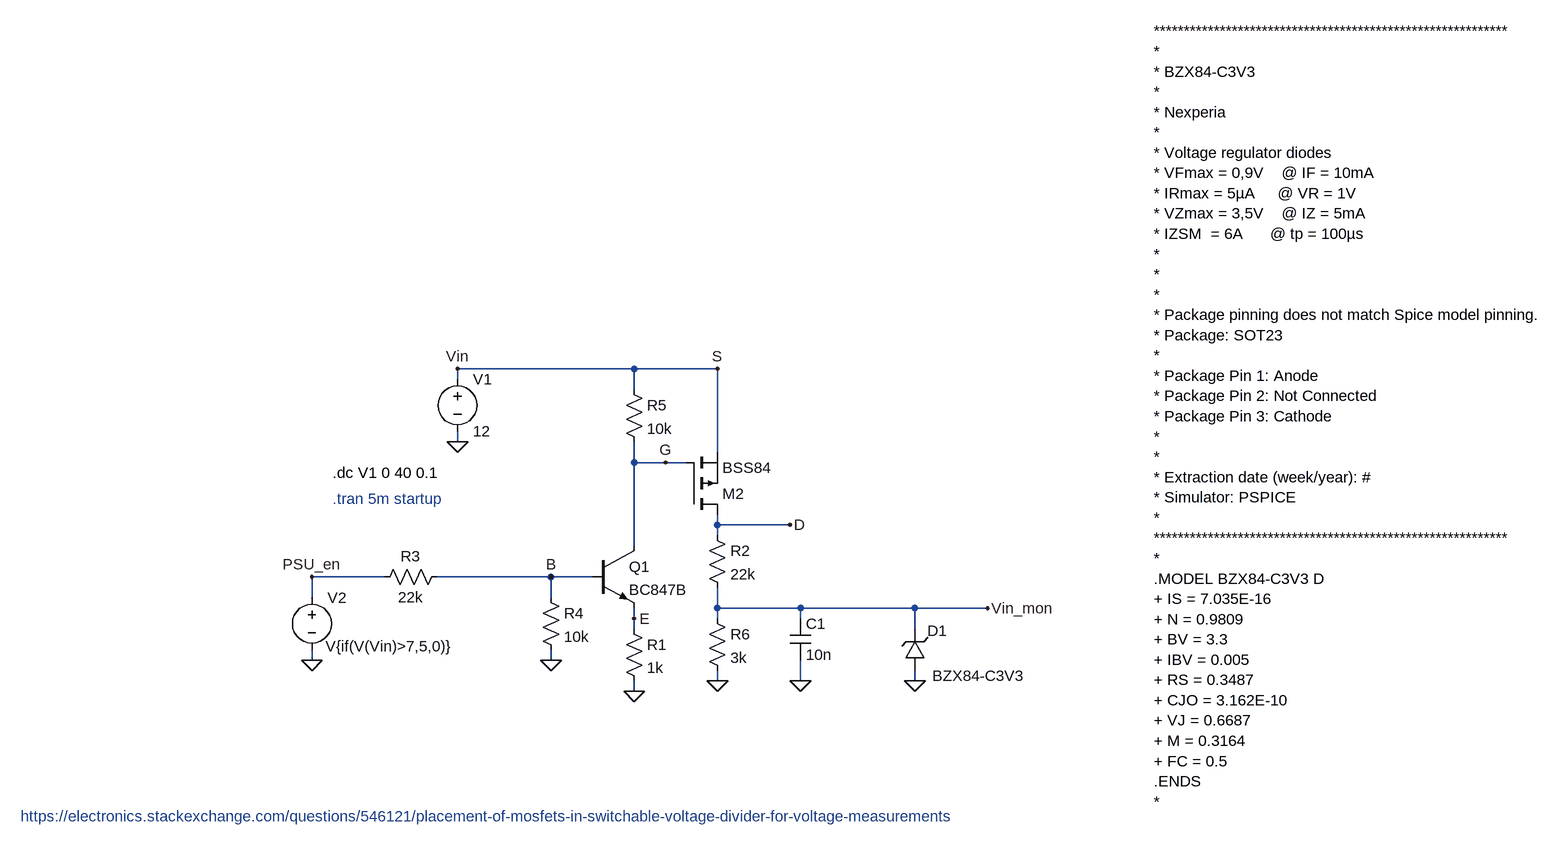
[diagram p0: schematic Vin_mon_Sasi.asc]
Vin_mon_Sasi.asc, the LTspice schematic file:
Version 4
SHEET 1 3136 1344
WIRE 192 96 -80 96
WIRE 320 96 192 96
WIRE -80 112 -80 96
WIRE 192 128 192 96
WIRE -80 208 -80 192
WIRE 320 224 320 96
WIRE 192 240 192 208
WIRE 240 240 192 240
WIRE 272 240 240 240
WIRE 320 336 320 320
WIRE 432 336 320 336
WIRE 320 352 320 336
WIRE 192 368 192 240
WIRE -192 416 -304 416
WIRE 64 416 -112 416
WIRE 128 416 64 416
WIRE -304 448 -304 416
WIRE 64 448 64 416
WIRE 320 464 320 432
WIRE 448 464 320 464
WIRE 624 464 448 464
WIRE 736 464 624 464
WIRE 192 480 192 464
WIRE 320 480 320 464
WIRE 448 480 448 464
WIRE 192 496 192 480
WIRE 624 496 624 464
WIRE -304 544 -304 528
WIRE 64 544 64 528
WIRE 320 576 320 560
WIRE 448 576 448 544
WIRE 624 576 624 560
WIRE 192 592 192 576
FLAG 64 544 0
FLAG 192 592 0
FLAG -304 544 0
FLAG -80 208 0
FLAG 736 464 Vin_mon
FLAG 448 576 0
FLAG 624 576 0
FLAG 320 576 0
FLAG -304 416 PSU_en
FLAG -80 96 Vin
FLAG 64 416 B
FLAG 240 240 G
FLAG 192 480 E
FLAG 432 336 D
FLAG 320 96 S
SYMBOL voltage -80 96 R0
WINDOW 123 0 0 Left 0
WINDOW 39 0 0 Left 0
SYMATTR InstName V1
SYMATTR Value 12
SYMBOL voltage -304 432 R0
WINDOW 3 21 91 Left 2
SYMATTR InstName V2
SYMATTR Value V{if(V(Vin)>7,5,0)}
SYMATTR Prefix B
SYMBOL res -208 432 R270
WINDOW 0 32 56 VTop 2
WINDOW 3 0 56 VBottom 2
SYMATTR InstName R3
SYMATTR Value 22k
SYMBOL res 48 432 R0
SYMATTR InstName R4
SYMATTR Value 10k
SYMBOL pmos 272 320 M180
SYMATTR InstName M2
SYMATTR Value BSS84
SYMBOL npn 128 368 R0
SYMATTR InstName Q1
SYMATTR Value BC847B
SYMBOL cap 432 480 R0
SYMATTR InstName C1
SYMATTR Value 10n
SYMBOL zener 640 560 R180
WINDOW 0 -34 61 Left 2
WINDOW 3 -153 -8 Left 2
SYMATTR InstName D1
SYMATTR Value BZX84-C3V3
SYMBOL res 304 336 R0
SYMATTR InstName R2
SYMATTR Value 22k
SYMBOL res 304 464 R0
SYMATTR InstName R6
SYMATTR Value 3k
SYMBOL res 176 112 R0
SYMATTR InstName R5
SYMATTR Value 10k
SYMBOL res 176 480 R0
SYMATTR InstName R1
SYMATTR Value 1k
TEXT -272 256 Left 2 !.dc V1 0 40 0.1
TEXT -272 296 Left 2 ;.tran 5m startup
TEXT -752 784 Left 2 ;https://electronics.stackexchange.com/questions/546121/placement-of-mosfets-in-switchable-voltage-divider-for-voltage-measurements
TEXT 992 -424 Left 2 !***********************************************************\n*\n* BZX84-C3V3\n*\n* Nexperia\n*\n* Voltage regulator diodes\n* VFmax = 0,9V    @ IF = 10mA\n* IRmax = 5µA     @ VR = 1V\n* VZmax = 3,5V    @ IZ = 5mA\n* IZSM  = 6A      @ tp = 100µs\n*\n*\n*\n* Package pinning does not match Spice model pinning.\n* Package: SOT23\n*\n* Package Pin 1: Anode\n* Package Pin 2: Not Connected\n* Package Pin 3: Cathode\n*\n*\n* Extraction date (week/year): #\n* Simulator: PSPICE\n*\n***********************************************************\n*\n.MODEL BZX84-C3V3 D\n+ IS = 7.035E-16\n+ N = 0.9809\n+ BV = 3.3\n+ IBV = 0.005\n+ RS = 0.3487\n+ CJO = 3.162E-10\n+ VJ = 0.6687\n+ M = 0.3164\n+ FC = 0.5\n.ENDS\n*

The netlist it stands for:
* Vin_mon_Sasi.asc
V1 S 0 12
B§V2 PSU_en 0 V{if(V(Vin)>7,5,0)}
R3 PSU_en B 22k
R4 B 0 10k
M2 D G S S BSS84
Q1 G B E 0 BC847B
C1 Vin_mon 0 10n
D1 0 Vin_mon BZX84-C3V3
R2 D Vin_mon 22k
R6 Vin_mon 0 3k
R5 S G 10k
R1 E 0 1k
.model D D
.lib standard.dio
.model NPN NPN
.model PNP PNP
.lib standard.bjt
.model NMOS NMOS
.model PMOS PMOS
.lib standard.mos
.dc V1 0 40 0.1
* .tran 5m startup
* https://electronics.stackexchange.com/questions/546121/placement-of-mosfets-in-switchable-voltage-divider-for-voltage-measurements
***********************************************************
*
* BZX84-C3V3
*
* Nexperia
*
* Voltage regulator diodes
* VFmax = 0,9V    @ IF = 10mA
* IRmax = 5µA     @ VR = 1V
* VZmax = 3,5V    @ IZ = 5mA
* IZSM  = 6A      @ tp = 100µs
*
*
*
* Package pinning does not match Spice model pinning.
* Package: SOT23
*
* Package Pin 1: Anode
* Package Pin 2: Not Connected
* Package Pin 3: Cathode
*
*
* Extraction date (week/year): #
* Simulator: PSPICE
*
***********************************************************
*
.MODEL BZX84-C3V3 D
+ IS = 7.035E-16
+ N = 0.9809
+ BV = 3.3
+ IBV = 0.005
+ RS = 0.3487
+ CJO = 3.162E-10
+ VJ = 0.6687
+ M = 0.3164
+ FC = 0.5
.ENDS
*
.backanno
.end